# EAGLE schematic StearnsN2b (EAGLE 6.6.0)
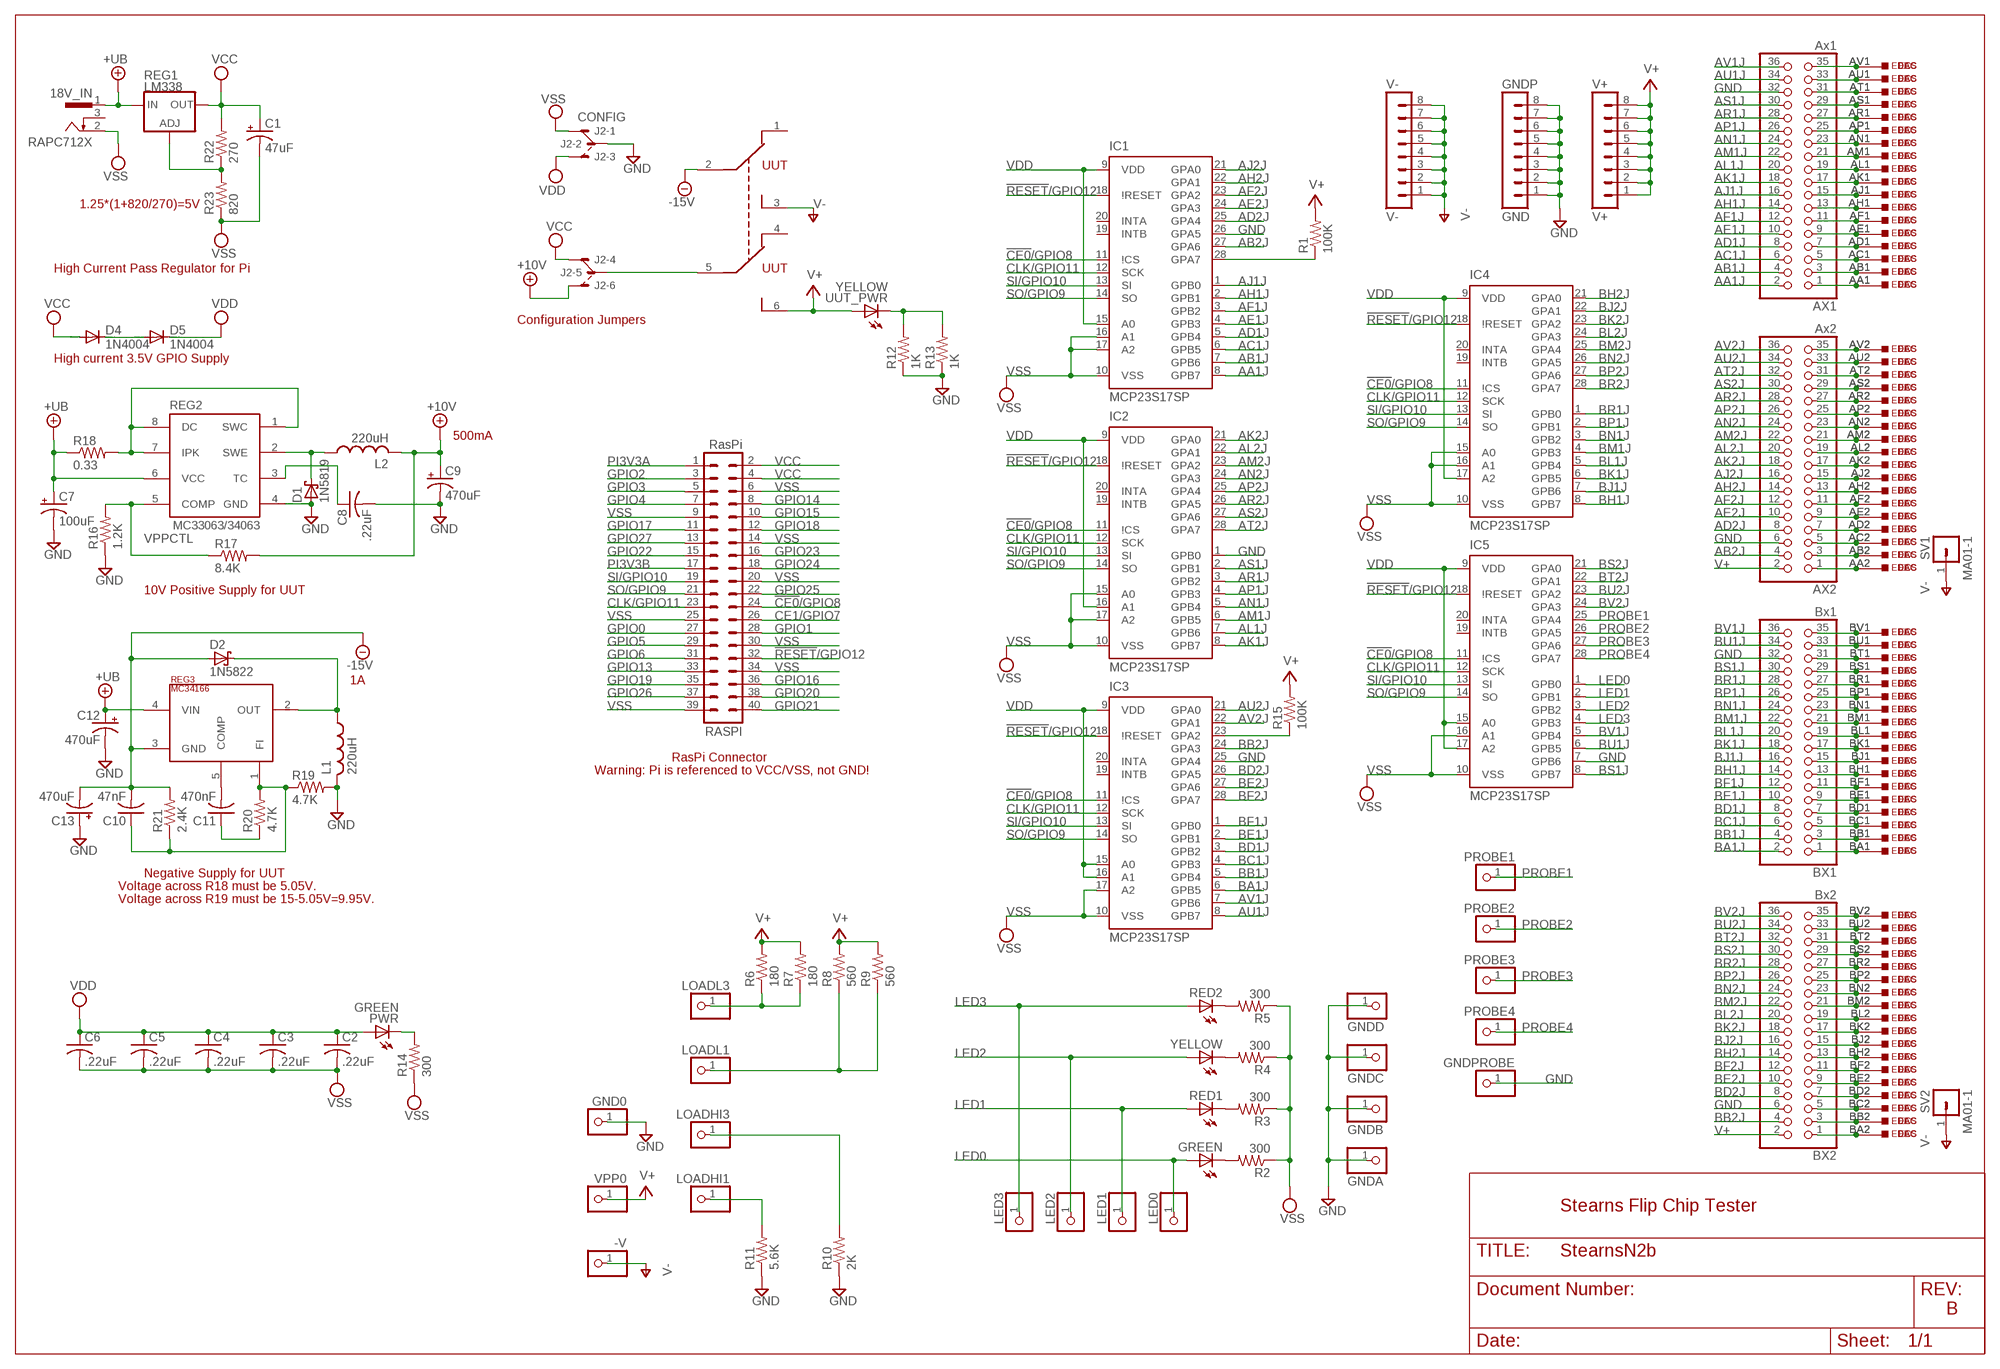
[diagram p0: schematic, sheet 1]

## Parts
18V_IN  RAPC712X  SCD-014A  [SCD-014-A]
-V  PINHD-1X1  [1X01]
AX1  Ax1  PINHD-2X18  [2X18]
AX2  Ax2  PINHD-2X18  [2X18]
BX1  Bx1  PINHD-2X18  [2X18]
BX2  Bx2  PINHD-2X18  [2X18]
C1  47uF  CPOL-USE5-8.5  [E5-8,5]
C2  .22uF  C-US050-025X075  [C050-025X075]
C3  .22uF  C-US050-025X075  [C050-025X075]
C4  .22uF  C-US050-025X075  [C050-025X075]
C5  .22uF  C-US050-025X075  [C050-025X075]
C6  .22uF  C-US050-025X075  [C050-025X075]
C7  100uF  CPOL-USTT2D7  [TT2D7]
C8  .22uF  C-US050-025X075  [C050-025X075]
C9  470uF  CPOL-USE5-8.5  [E5-8,5]
C10  47nF  C-US050-025X075  [C050-025X075]
C11  470nF  C-US050-025X075  [C050-025X075]
C12  470uF  CPOL-USE5-8.5  [E5-8,5]
C13  470uF  CPOL-USE5-8.5  [E5-8,5]
D1  1N5819  SCHOTTKY-DIODEDO35-7  [DO35-7]
D2  1N5822  SCHOTTKY-DIODEDO201T15  [DO201T15]
D4  1N4004  [DO41-10]
D5  1N4004  [DO41-10]
DEC  W971  [H807-2]
ECS  W971ECS  [ECS2418-2]
EDAC  W971EDAC  [EDAC346-36-2]
GND0  PINHD-1X1  [1X01]
GNDA  PINHD-1X1  [1X01]
GNDB  PINHD-1X1  [1X01]
GNDC  PINHD-1X1  [1X01]
GNDD  PINHD-1X1  [1X01]
GNDP  GND  MA08-1  [MA08-1]
GNDPROBE  PINHD-1X1  [1X01]
GREEN  LED5MM  [LED5MM]
IC1  MCP23S17SP  [DIL28-3]
IC2  MCP23S17SP  [DIL28-3]
IC3  MCP23S17SP  [DIL28-3]
IC4  MCP23S17SP  [DIL28-3]
IC5  MCP23S17SP  [DIL28-3]
J2  CONFIG  22-23-2061  [22-23-2061]
L1  220uH  L-US6000-XXX-RC  [6000-XXXX-RC]
L2  220uH  L-US6000-XXX-RC  [6000-XXXX-RC]
LED0  PINHD-1X1  [1X01]
LED1  PINHD-1X1  [1X01]
LED2  PINHD-1X1  [1X01]
LED3  PINHD-1X1  [1X01]
LOADHI1  PINHD-1X1  [1X01]
LOADHI3  PINHD-1X1  [1X01]
LOADL1  PINHD-1X1  [1X01]
LOADL3  PINHD-1X1  [1X01]
PROBE1  PINHD-1X1  [1X01]
PROBE2  PINHD-1X1  [1X01]
PROBE3  PINHD-1X1  [1X01]
PROBE4  PINHD-1X1  [1X01]
PWR  GREEN  LED5MM  [LED5MM]
R1  100K  R-US_0207/10  [0207/10]
R2  300  R-US_0207/10  [0207/10]
R3  300  R-US_0207/10  [0207/10]
R4  300  R-US_0207/10  [0207/10]
R5  300  R-US_0207/10  [0207/10]
R6  180  R-US_0207/10  [0207/10]
R7  180  R-US_0207/10  [0207/10]
R8  560  R-US_0207/10  [0207/10]
R9  560  R-US_0207/10  [0207/10]
R10  2K  R-US_0207/10  [0207/10]
R11  5.6K  R-US_0207/10  [0207/10]
R12  1K  R-US_0207/10  [0207/10]
R13  1K  R-US_0207/10  [0207/10]
R14  300  R-US_0207/10  [0207/10]
R15  100K  R-US_0207/10  [0207/10]
R16  1.2K  R-US_0207/10  [0207/10]
R17  8.4K  R-US_0207/10  [0207/10]
R18  0.33  R-US_0207/10  [0207/10]
R19  4.7K  R-US_0207/10  [0207/10]
R20  4.7K  R-US_0207/10  [0207/10]
R21  2.4K  R-US_0207/10  [0207/10]
R22  270  R-US_0207/10  [0207/10]
R23  820  R-US_0207/10  [0207/10]
RASPI  RasPi  MA20-2  [MA20-2]
RED1  LED5MM  [LED5MM]
RED2  LED5MM  [LED5MM]
REG1  LM338  LM138-TL  [TO220L1]
REG2  MC33063/MC34063P  [DIL08]
REG3  MC34166  [TO220-52]
SV1  MA01-1  [MA01-1]
SV2  MA01-1  [MA01-1]
UUT  720X  [7209MD9V3]
UUT_PWR  YELLOW  LED5MM  [LED5MM]
V+  V+  MA08-1  [MA08-1]
V-  V-  MA08-1  [MA08-1]
VPP0  PINHD-1X1  [1X01]
YELLOW  LED5MM  [LED5MM]

## Nets
!CE0!/GPIO8: IC1.11(\!CS) IC2.11(\!CS) IC3.11(\!CS) IC4.11(\!CS) IC5.11(\!CS) RASPI.24
!RESET!/GPIO12: IC1.18(\!RESET) IC2.18(\!RESET) IC3.18(\!RESET) IC4.18(\!RESET) IC5.18(\!RESET) RASPI.32
+10V [Supply]: C9.+ J2.6 L2.2 R17.2
+UB [Supply]: 18V_IN.1 C7.+ C12.+ R18.1 REG1.3(IN) REG2.6(VCC) REG3.4(VIN)
-15V [Supply]: C10.2 C13.- D2.A R21.2 REG3.3(GND) UUT.2(A2)
AA1J: AX1.2 IC1.8(GPB7)
AB1J: AX1.4 IC1.7(GPB6)
AB2J [Supply]: AX2.4 IC1.27(GPA6)
AC1J: AX1.6 IC1.6(GPB5)
AD1J: AX1.8 IC1.5(GPB4)
AD2J: AX2.8 IC1.25(GPA4)
AE1J: AX1.10 IC1.4(GPB3)
AE2J: AX2.10 IC1.24(GPA3)
AF1J: AX1.12 IC1.3(GPB2)
AF2J: AX2.12 IC1.23(GPA2)
AH1J: AX1.14 IC1.2(GPB1)
AH2J: AX2.14 IC1.22(GPA1)
AJ1J: AX1.16 IC1.1(GPB0)
AJ2J: AX2.16 IC1.21(GPA0)
AK1J: AX1.18 IC2.8(GPB7)
AK2J: AX2.18 IC2.21(GPA0)
AL1J: AX1.20 IC2.7(GPB6)
AL2J: AX2.20 IC2.22(GPA1)
AM1J: AX1.22 IC2.6(GPB5)
AM2J: AX2.22 IC2.23(GPA2)
AN1J: AX1.24 IC2.5(GPB4)
AN2J: AX2.24 IC2.24(GPA3)
AP1J: AX1.26 IC2.4(GPB3)
AP2J: AX2.26 IC2.25(GPA4)
AR1J: AX1.28 IC2.3(GPB2)
AR2J: AX2.28 IC2.26(GPA5)
AS1J: AX1.30 IC2.2(GPB1)
AS2J: AX2.30 IC2.27(GPA6)
AT2J: AX2.32 IC2.28(GPA7)
AU1J: AX1.34 IC3.8(GPB7)
AU2J: AX2.34 IC3.21(GPA0)
AV1J: AX1.36 IC3.7(GPB6)
AV2J: AX2.36 IC3.22(GPA1)
BA1J: BX1.2 IC3.6(GPB5)
BB1J: BX1.4 IC3.5(GPB4)
BB2J: BX2.4 IC3.24(GPA3)
BC1J: BX1.6 IC3.4(GPB3)
BD1J: BX1.8 IC3.3(GPB2)
BD2J: BX2.8 IC3.26(GPA5)
BE1J: BX1.10 IC3.2(GPB1)
BE2J: BX2.10 IC3.27(GPA6)
BF1J: BX1.12 IC3.1(GPB0)
BF2J: BX2.12 IC3.28(GPA7)
BH1J: BX1.14 IC4.8(GPB7)
BH2J: BX2.14 IC4.21(GPA0)
BJ1J: BX1.16 IC4.7(GPB6)
BJ2J: BX2.16 IC4.22(GPA1)
BK1J: BX1.18 IC4.6(GPB5)
BK2J: BX2.18 IC4.23(GPA2)
BL1J: BX1.20 IC4.5(GPB4)
BL2J: BX2.20 IC4.24(GPA3)
BM1J: BX1.22 IC4.4(GPB3)
BM2J: BX2.22 IC4.25(GPA4)
BN1J: BX1.24 IC4.3(GPB2)
BN2J: BX2.24 IC4.26(GPA5)
BP1J: BX1.26 IC4.2(GPB1)
BP2J: BX2.26 IC4.27(GPA6)
BR1J: BX1.28 IC4.1(GPB0)
BR2J: BX2.28 IC4.28(GPA7)
BS1J: BX1.30 IC5.8(GPB7)
BS2J: BX2.30 IC5.21(GPA0)
BT2J: BX2.32 IC5.22(GPA1)
BU1J: BX1.34 IC5.6(GPB5)
BU2J: BX2.34 IC5.23(GPA2)
BV1J: BX1.36 IC5.5(GPB4)
BV2J: BX2.36 IC5.24(GPA3)
CE1/GPIO7: RASPI.26
CLK/GPIO11: IC1.12(SCK) IC2.12(SCK) IC3.12(SCK) IC4.12(SCK) IC5.12(SCK) RASPI.23
GND [Supply]: AX1.32 AX2.6 BX1.32 BX2.6 C7.- C8.2 C9.- C12.- C13.+ D1.A GND0.1 GNDA.1 GNDB.1 GNDC.1 GNDD.1 GNDP.1 GNDP.2 GNDP.3 GNDP.4 GNDP.5 GNDP.6 GNDP.7 GNDP.8 GNDPROBE.1 IC1.26(GPA5) IC2.1(GPB0) IC3.25(GPA4) IC5.7(GPB6) J2.2 L1.2 R10.1 R11.1 R12.1 R13.1 R16.1 R19.2 REG2.4(GND)
GPIO0: RASPI.27
GPIO1: RASPI.28
GPIO2: RASPI.3
GPIO3: RASPI.5
GPIO4: RASPI.7
GPIO5: RASPI.29
GPIO6: RASPI.31
GPIO13: RASPI.33
GPIO14: RASPI.8
GPIO15: RASPI.10
GPIO16: RASPI.36
GPIO17: RASPI.11
GPIO18: RASPI.12
GPIO19: RASPI.35
GPIO20: RASPI.38
GPIO21: RASPI.40
GPIO22: RASPI.15
GPIO23: RASPI.16
GPIO24: RASPI.18
GPIO25: RASPI.22
GPIO26: RASPI.37
GPIO27: RASPI.13
LED0: GREEN.A IC5.1(GPB0) LED0.1
LED1: IC5.2(GPB1) LED1.1 RED1.A
LED2: IC5.3(GPB2) LED2.1 YELLOW.A
LED3: IC5.4(GPB3) LED3.1 RED2.A
N$1: AX1.1 DEC.AA1 ECS.AA1 EDAC.AA1
N$2: AX1.35 DEC.AV1 ECS.AV1 EDAC.AV1
N$3: AX1.33 DEC.AU1 ECS.AU1 EDAC.AU1
N$4: AX1.31 DEC.AT1 ECS.AT1 EDAC.AT1
N$5: AX1.29 DEC.AS1 ECS.AS1 EDAC.AS1
N$6: AX1.27 DEC.AR1 ECS.AR1 EDAC.AR1
N$7: AX1.25 DEC.AP1 ECS.AP1 EDAC.AP1
N$8: AX1.23 DEC.AN1 ECS.AN1 EDAC.AN1
N$9: AX1.21 DEC.AM1 ECS.AM1 EDAC.AM1
N$10: AX1.19 DEC.AL1 ECS.AL1 EDAC.AL1
N$11: AX1.17 DEC.AK1 ECS.AK1 EDAC.AK1
N$12: AX1.15 DEC.AJ1 ECS.AJ1 EDAC.AJ1
N$13: AX1.13 DEC.AH1 ECS.AH1 EDAC.AH1
N$14: AX1.11 DEC.AF1 ECS.AF1 EDAC.AF1
N$15: AX1.9 DEC.AE1 ECS.AE1 EDAC.AE1
N$16: AX1.7 DEC.AD1 ECS.AD1 EDAC.AD1
N$17: AX1.5 DEC.AC1 ECS.AC1 EDAC.AC1
N$18: AX1.3 DEC.AB1 ECS.AB1 EDAC.AB1
N$19: AX2.1 DEC.AA2 ECS.AA2 EDAC.AA2
N$20: AX2.3 DEC.AB2 ECS.AB2 EDAC.AB2
N$21: AX2.5 DEC.AC2 ECS.AC2 EDAC.AC2
N$22: AX2.7 DEC.AD2 ECS.AD2 EDAC.AD2
N$23: AX2.9 DEC.AE2 ECS.AE2 EDAC.AE2
N$24: AX2.11 DEC.AF2 ECS.AF2 EDAC.AF2
N$25: AX2.13 DEC.AH2 ECS.AH2 EDAC.AH2
N$26: AX2.15 DEC.AJ2 ECS.AJ2 EDAC.AJ2
N$27: AX2.17 DEC.AK2 ECS.AK2 EDAC.AK2
N$28: AX2.19 DEC.AL2 ECS.AL2 EDAC.AL2
N$29: AX2.21 DEC.AM2 ECS.AM2 EDAC.AM2
N$30: AX2.23 DEC.AN2 ECS.AN2 EDAC.AN2
N$31: AX2.25 DEC.AP2 ECS.AP2 EDAC.AP2
N$32: AX2.27 DEC.AR2 ECS.AR2 EDAC.AR2
N$33: AX2.29 DEC.AS2 ECS.AS2 EDAC.AS2
N$34: AX2.31 DEC.AT2 ECS.AT2 EDAC.AT2
N$35: AX2.33 DEC.AU2 ECS.AU2 EDAC.AU2
N$36: AX2.35 DEC.AV2 ECS.AV2 EDAC.AV2
N$37: BX2.1 DEC.BA2 ECS.BA2 EDAC.BA2
N$38: BX2.3 DEC.BB2 ECS.BB2 EDAC.BB2
N$39: BX2.5 DEC.BC2 ECS.BC2 EDAC.BC2
N$40: BX2.7 DEC.BD2 ECS.BD2 EDAC.BD2
N$41: BX2.9 DEC.BE2 ECS.BE2 EDAC.BE2
N$42: BX2.11 DEC.BF2 ECS.BF2 EDAC.BF2
N$43: BX2.13 DEC.BH2 ECS.BH2 EDAC.BH2
N$44: BX2.15 DEC.BJ2 ECS.BJ2 EDAC.BJ2
N$45: BX2.17 DEC.BK2 ECS.BK2 EDAC.BK2
N$46: BX2.19 DEC.BL2 ECS.BL2 EDAC.BL2
N$47: BX2.21 DEC.BM2 ECS.BM2 EDAC.BM2
N$48: BX2.23 DEC.BN2 ECS.BN2 EDAC.BN2
N$49: BX2.25 DEC.BP2 ECS.BP2 EDAC.BP2
N$50: BX2.27 DEC.BR2 ECS.BR2 EDAC.BR2
N$51: BX2.29 DEC.BS2 ECS.BS2 EDAC.BS2
N$52: BX2.31 DEC.BT2 ECS.BT2 EDAC.BT2
N$53: BX2.33 DEC.BU2 ECS.BU2 EDAC.BU2
N$54: BX2.35 DEC.BV2 ECS.BV2 EDAC.BV2
N$55: BX1.1 DEC.BA1 ECS.BA1 EDAC.BA1
N$56: BX1.3 DEC.BB1 ECS.BB1 EDAC.BB1
N$57: BX1.5 DEC.BC1 ECS.BC1 EDAC.BC1
N$58: BX1.7 DEC.BD1 ECS.BD1 EDAC.BD1
N$59: BX1.9 DEC.BE1 ECS.BE1 EDAC.BE1
N$60: BX1.11 DEC.BF1 ECS.BF1 EDAC.BF1
N$61: BX1.13 DEC.BH1 ECS.BH1 EDAC.BH1
N$62: BX1.15 DEC.BJ1 ECS.BJ1 EDAC.BJ1
N$63: BX1.17 DEC.BK1 ECS.BK1 EDAC.BK1
N$64: BX1.19 DEC.BL1 ECS.BL1 EDAC.BL1
N$65: BX1.21 DEC.BM1 ECS.BM1 EDAC.BM1
N$66: BX1.23 DEC.BN1 ECS.BN1 EDAC.BN1
N$67: BX1.25 DEC.BP1 ECS.BP1 EDAC.BP1
N$68: BX1.27 DEC.BR1 ECS.BR1 EDAC.BR1
N$69: BX1.29 DEC.BS1 ECS.BS1 EDAC.BS1
N$70: BX1.31 DEC.BT1 ECS.BT1 EDAC.BT1
N$71: BX1.33 DEC.BU1 ECS.BU1 EDAC.BU1
N$72: BX1.35 DEC.BV1 ECS.BV1 EDAC.BV1
N$73: GREEN.K(C) R2.2
N$74: R3.2 RED1.K(C)
N$75: R4.2 YELLOW.K(C)
N$76: R5.2 RED2.K(C)
N$77: LOADL3.1 R6.1 R7.1
N$78: LOADL1.1 R8.1 R9.1
N$79: LOADHI1.1 R11.2
N$80: LOADHI3.1 R10.2
N$81: IC3.23(GPA2) R15.1
N$82: R12.2 R13.2 UUT_PWR.K(C)
N$83: PWR.K(C) R14.2
N$85 [Supply]: J2.5 UUT.5(B2)
N$89: D2.C L1.1 REG3.2(OUT)
N$90: C11.2 REG3.5(COMP)
N$91: C11.1 R20.1
N$92: D1.C L2.1 REG2.2(SWE)
N$93: R18.2 REG2.1(SWC) REG2.7(IPK) REG2.8(DC)
N$94: C10.1 R19.1 R20.2 R21.1 REG3.1(FI)
N$95: C8.1 REG2.3(TC)
N$107: IC1.28(GPA7) R1.1
N$112: R22.1 R23.2 REG1.1(ADJ)
N$116: D4.C D5.A
PI3V3A: RASPI.1
PI3V3B: RASPI.17
PROBE1: IC5.25(GPA4) PROBE1.1
PROBE2: IC5.26(GPA5) PROBE2.1
PROBE3: IC5.27(GPA6) PROBE3.1
PROBE4: IC5.28(GPA7) PROBE4.1
SI/GPIO10: IC1.13(SI) IC2.13(SI) IC3.13(SI) IC4.13(SI) IC5.13(SI) RASPI.19
SO/GPIO9: IC1.14(SO) IC2.14(SO) IC3.14(SO) IC4.14(SO) IC5.14(SO) RASPI.21
V+ [Supply]: AX2.2 BX2.2 R1.2 R6.2 R7.2 R8.2 R9.2 R15.2 UUT.6(B3) UUT_PWR.A V+.1 V+.2 V+.3 V+.4 V+.5 V+.6 V+.7 V+.8 VPP0.1
V- [Supply]: -V.1 SV1.1 SV2.1 UUT.3(A3) V-.1 V-.2 V-.3 V-.4 V-.5 V-.6 V-.7 V-.8
VCC [Supply]: C1.+ D4.A J2.4 R22.2 RASPI.2 RASPI.4 REG1.2(OUT)
VDD [Supply]: C2.1 C3.1 C4.1 C5.1 C6.1 D5.C IC1.9(VDD) IC1.15(A0) IC2.9(VDD) IC2.16(A1) IC3.9(VDD) IC3.15(A0) IC3.16(A1) IC4.9(VDD) IC4.17(A2) IC5.9(VDD) IC5.15(A0) IC5.17(A2) J2.3 PWR.A
VPPCTL: R16.2 R17.1 REG2.5(COMP)
VSS [Supply]: 18V_IN.2 C1.- C2.2 C3.2 C4.2 C5.2 C6.2 IC1.10(VSS) IC1.16(A1) IC1.17(A2) IC2.10(VSS) IC2.15(A0) IC2.17(A2) IC3.10(VSS) IC3.17(A2) IC4.10(VSS) IC4.15(A0) IC4.16(A1) IC5.10(VSS) IC5.16(A1) J2.1 R2.1 R3.1 R4.1 R5.1 R14.1 R23.1 RASPI.6 RASPI.9 RASPI.14 RASPI.20 RASPI.25 RASPI.30 RASPI.34 RASPI.39
Unconnected: 18V_IN.3 IC1.19(INTB) IC1.20(INTA) IC2.19(INTB) IC2.20(INTA) IC3.19(INTB) IC3.20(INTA) IC4.19(INTB) IC4.20(INTA) IC5.19(INTB) IC5.20(INTA) UUT.1(A1) UUT.4(B1)

## Notes on the sheet
- 1.25*(1+820/270)=5V
- High Current Pass Regulator for Pi
- Configuration Jumpers
- High current 3.5V GPIO Supply
- 500mA
- 10V Positive Supply for UUT
- 1A
- RasPi Connector
- Warning: Pi is referenced to VCC/VSS, not GND!
- Negative Supply for UUT
- Voltage across R18 must be 5.05V.
- Voltage across R19 must be 15-5.05V=9.95V.
- Stearns Flip Chip Tester
- B

## Power pins joined to a net without a drawn wire
GND: UUT.NC@1(GND) UUT.NC@2(GND) UUT.NC@3(GND) UUT.NC@4(GND) UUT.NC@5(GND) UUT.NC@6(GND) UUT.NC@7(GND) UUT.NC@8(GND)

## Library data of the parts
18V_IN = con-shiua-chyuan:SCD-014A: Power Jack 2.5mm; OC_FARNELL: unknown; OC_NEWARK: unknown
-V GND0 GNDA GNDB GNDC GNDD GNDPROBE LED0 LED1-LED3 LOADHI1 LOADHI3 LOADL1 LOADL3 PROBE1-PROBE4 VPP0 = pinhead:PINHD-1X1: PIN HEADER
AX1 AX2 BX1 BX2 = pinhead:PINHD-2X18: PIN HEADER
C1 C7 C9 C12 C13 = rcl:CPOL-US: POLARIZED CAPACITOR, American symbol
C2-C6 C8 C10 C11 = rcl:C-US: CAPACITOR, American symbol
D1 D2 = diode:SCHOTTKY-DIODE: Schottky Diode
D4 D5 = diode:1N4004: DIODE general purpose rectifier, 1 A
DEC ECS EDAC = dec-m:W971: Double sided Double Height Connector, 72 pins
GNDP V+ V- = con-lstb:MA08-1: PIN HEADER; OC_FARNELL: unknown; OC_NEWARK: unknown
GREEN PWR RED1 RED2 UUT_PWR YELLOW = led:LED: LED OSRAM: - CHIPLED LG R971, LG N971, LY N971, LG Q971, LY Q971, LO R971, LY R971 LH N974, LH R974 LS Q976, LO Q976, LY Q976 LO Q996 - Hyper CHIPLED LW Q18S LB Q993, LB Q99A, LB R99A - SideLED LS A670, LO A670, LY A670, LG A670, LP A670 LB A673, LV A673, LT A673, LW A673 LH A674 LY A675 LS A676, LA A676, LO A676, LY A676, LW A676 LS A679, LY A679, LG A679 - Hyper Micro SIDELED® LS Y876, LA Y876, LO Y876, LY Y876 LT Y87S - SmartLED LW L88C, LW L88S LB L89C, LB L89S, LG L890 LS L89K, LO L89K, LY L89K LS L896, LA L896, LO L896, LY L896 - TOPLED LS T670, LO T670, LY T670, LG T670, LP T670 LSG T670, LSP T670, LSY T670, LOP T670, LYG T670 LG T671, LOG T671, LSG T671 LB T673, LV T673, LT T673, LW T673 LH T674 LS T676, LA T676, LO T676, LY T676, LB T676, LH T676, LSB T676, LW T676 LB T67C, LV T67C, LT T67C, LS T67K, LO T67K, LY T67K, LW E67C LS E67B, LA E67B, LO E67B, LY E67B, LB E67C, LV E67C, LT E67C LW T67C LS T679, LY T679, LG T679 LS T770, LO T770, LY T770, LG T770, LP T770 LB T773, LV T773, LT T773, LW T773 LH T774 LS E675, LA E675, LY E675, LS T675 LS T776, LA T776, LO T776, LY T776, LB T776 LHGB T686 LT T68C, LB T68C - Hyper Mini TOPLED® LB M676 - Mini TOPLED Santana® LG M470 LS M47K, LO M47K, LY M47K Source: http://www.osram.convergy.de LUXEON: - LUMILED® LXK2-PW12-R00, LXK2-PW12-S00, LXK2-PW14-U00, LXK2-PW14-V00 LXK2-PM12-R00, LXK2-PM12-S00, LXK2-PM14-U00 LXK2-PE12-Q00, LXK2-PE12-R00, LXK2-PE12-S00, LXK2-PE14-T00, LXK2-PE14-U00 LXK2-PB12-K00, LXK2-PB12-L00, LXK2-PB12-M00, LXK2-PB14-N00, LXK2-PB14-P00, LXK2-PB14-Q00 LXK2-PR12-L00, LXK2-PR12-M00, LXK2-PR14-Q00, LXK2-PR14-R00 LXK2-PD12-Q00, LXK2-PD12-R00, LXK2-PD12-S00 LXK2-PH12-R00, LXK2-PH12-S00 LXK2-PL12-P00, LXK2-PL12-Q00, LXK2-PL12-R00 Source: www.luxeon.com KINGBRIGHT: KA-3528ASYC Source: www.kingbright.com
IC1-IC5 = MCP23S17:MCP23S17: http://ww1.microchip.com/downloads/en/DeviceDoc/21952a.pdf Source: http://ww1.microchip.com/downloads/en/DeviceDoc/21952a.pdf
J2 = con-molex:22-23-2061: .100" (2.54mm) Center Header - 6 Pin; MF: MOLEX; MPN: 22-23-2061; OC_FARNELL: 1462922; OC_NEWARK: 27C1933
L1 L2 = rcl:L-US: INDUCTOR, American symbol
R1-R23 = rcl:R-US_: RESISTOR, American symbol
RASPI = con-lstb:MA20-2: PIN HEADER; OC_FARNELL: unknown; OC_NEWARK: unknown
REG1 = v-reg:LM138-TL: VOLTAGE REGULATOR
REG2 = adafruit:MC33063/MC34063: MC33063 and MC34063 Basic DC/DC converter with internal power-NPN transistor, 100KHz, 1.5A peak switch current. 3-40 input/output.
REG3 = MC34166:MC34166: MC34166 Switching Regulator
SV1 SV2 = dec-con:MA01-1: Pin Header (.125" spacing)
UUT = dec-con:720X: 720x Switch with mounting brackets.

## Net classes
1 Supply: width 0.813 mm